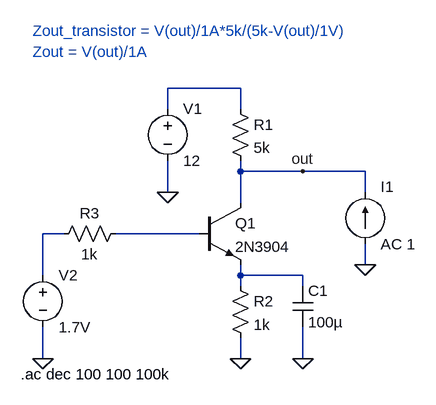
[diagram p0: schematic Zout_transistor.asc]
Zout_transistor.asc, the LTspice schematic file:
Version 4
SHEET 1 880 680
WIRE 272 -96 160 -96
WIRE 160 -64 160 -96
WIRE 272 -64 272 -96
WIRE 272 32 272 16
WIRE 368 32 272 32
WIRE 464 32 368 32
WIRE 160 64 160 16
WIRE 464 64 464 32
WIRE 272 80 272 32
WIRE 0 128 -32 128
WIRE 208 128 80 128
WIRE 464 176 464 144
WIRE -32 192 -32 128
WIRE 272 192 272 176
WIRE 368 192 272 192
WIRE 272 208 272 192
WIRE 368 208 368 192
WIRE -32 320 -32 272
WIRE 272 320 272 288
WIRE 368 320 368 272
FLAG 160 64 0
FLAG -32 320 0
FLAG 272 320 0
FLAG 368 320 0
FLAG 368 32 out
FLAG 464 176 0
SYMBOL npn 208 80 R0
SYMATTR InstName Q1
SYMATTR Value 2N3904
SYMBOL res 256 -80 R0
SYMATTR InstName R1
SYMATTR Value 5k
SYMBOL res 256 192 R0
SYMATTR InstName R2
SYMATTR Value 1k
SYMBOL voltage 160 -80 R0
SYMATTR InstName V1
SYMATTR Value 12
SYMBOL voltage -32 176 R0
SYMATTR InstName V2
SYMATTR Value 1.7V
SYMBOL cap 352 208 R0
SYMATTR InstName C1
SYMATTR Value 100µ
SYMBOL res -16 144 R270
WINDOW 0 32 56 VTop 0
WINDOW 3 0 56 VBottom 0
SYMATTR InstName R3
SYMATTR Value 1k
SYMBOL current 464 144 M180
WINDOW 0 24 88 Left 0
WINDOW 3 24 0 Left 0
SYMATTR InstName I1
SYMATTR Value AC 1
TEXT -48 -152 Left 0 ;Zout = V(out)/1A
TEXT -66 344 Left 0 !.ac dec 100 100 100k
TEXT -48 -184 Left 0 ;Zout_transistor = V(out)/1A*5k/(5k-V(out)/1V)

The netlist it stands for:
* Zout_transistor.asc
Q1 out N003 N004 0 2N3904
R1 N001 out 5k
R2 N004 0 1k
V1 N001 0 12
V2 N002 0 1.7V
C1 N004 0 100µ
R3 N002 N003 1k
I1 0 out AC 1
.model NPN NPN
.model PNP PNP
.lib standard.bjt
* Zout = V(out)/1A
.ac dec 100 100 100k
* Zout_transistor = V(out)/1A*5k/(5k-V(out)/1V)
.backanno
.end